# EAGLE design Professional 1.2 (EAGLE 7.7.0)
Professional DOS Original by Wolfgang Moser GAL-Mod by Benutzername@Forum64
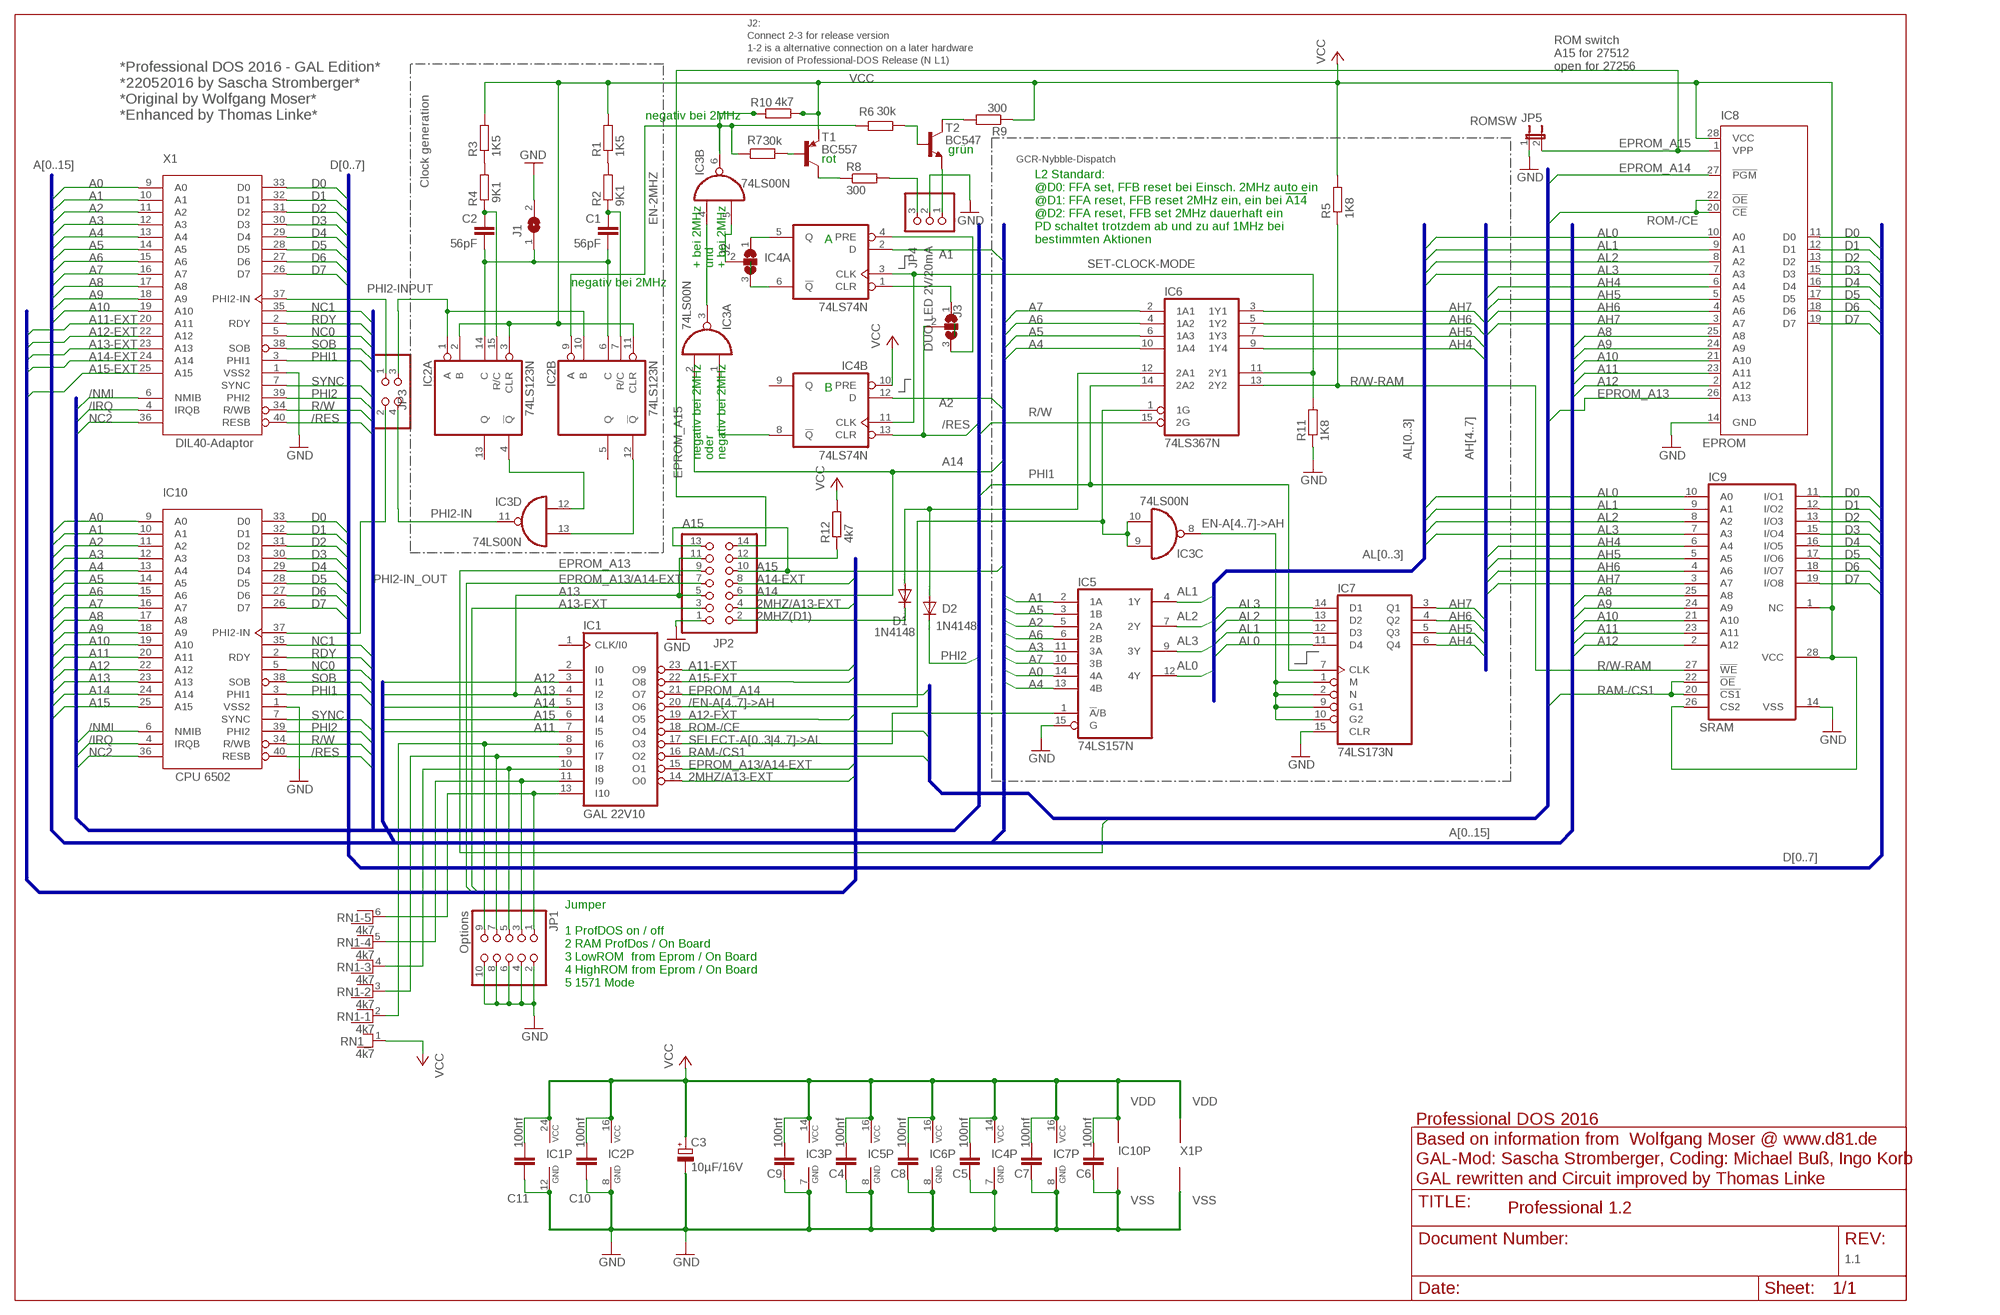
[diagram p0: schematic, sheet 1]

## Parts
C1  56pF  C-EU025-025X050  [C025-025X050]
C2  56pF  C-EU025-025X050  [C025-025X050]
C3  10µF/16V  CPOL-EUTT2D4  [TT2D4]
C4  100nf  C2.5/2  [C2.5-2]
C5  100nf  C2.5/2  [C2.5-2]
C6  100nf  C2.5/2  [C2.5-2]
C7  100nf  C2.5/2  [C2.5-2]
C8  100nf  C2.5/2  [C2.5-2]
C9  100nf  C2.5/2  [C2.5-2]
C10  100nf  C2.5/2  [C2.5-2]
C11  100nf  C2.5/2  [C2.5-2]
D1  1N4148  DIODE-D-5  [D-5]
D2  1N4148  DIODE-D-5  [D-5]
IC1  GAL 22V10  22V10  [DIL24-3]
IC2  74LS123N  [DIL16]
IC3  74LS00N  [DIL14]
IC4  74LS74N  [DIL14]
IC5  74LS157N  [DIL16]
IC6  74LS367N  74HC367N  [DIL16]
IC7  74LS173N  [DIL16]
IC8  EPROM  27C128P  [DIL28-6]
IC9  SRAM  6264A  [DIL28-6]
IC10  CPU 6502  G65SC02P  [DIL40]
J1  1  SJ  [SJ]
J2  Alternativ connection for old version  SJ2W  [SJ_2]
J3  Alternativ connection for old version  SJ2W  [SJ_2]
JP1  Options  PINHD-2X5  [2X05]
JP2  1  PINHD-2X7  [2X07]
JP3  1  PINHD-2X2  [2X02]
JP4  DUO LED 2V/20mA  PINHD-1X3  [1X03]
JP5  ROMSW  JP1E  [JP1]
R1  1K5  R-EU_0207/2V  [0207/2V]
R2  9K1  R-EU_0207/2V  [0207/2V]
R3  1K5  R-EU_0207/2V  [0207/2V]
R4  9K1  R-EU_0207/2V  [0207/2V]
R5  1K8  R-EU_0207/7  [0207/7]
R6  30k  R-EU_0207/2V  [0207/2V]
R7  30k  R-EU_0207/2V  [0207/2V]
R8  300  R-EU_0207/2V  [0207/2V]
R9  300  R-EU_0207/2V  [0207/2V]
R10  4k7  R-EU_0207/2V  [0207/2V]
R11  1K8  R-EU_0207/7  [0207/7]
R12  4k7  R-EU_0207/7  [0207/7]
RN1  4k7  RNX5  [RN-6]
T1  BC557  -PNP-TO92  [TO92]
T2  BC547  [TO92]
X1  DIL40-Adaptor  G65SC02PB  [DIL40-BPLACE]

## Nets
2MHZ(D1): D1.C JP2.2
2MHZ/A13-EXT: IC1.14(O0) JP2.4
/EN-A[4..7]->AH: IC1.20(O6) IC3.9(C:I0) IC3.10(C:I1) IC6.1(1G)
/IRQ: IC10.4(IRQB) X1.4(IRQB)
/NMI: IC10.6(NMIB) X1.6(NMIB)
/Q: IC4.6(A:!Q) J2.3
/RES: IC4.13(B:CLR) IC10.40(RESB) J3.2 X1.40(RESB)
A0: IC5.14(4A) IC10.9(A0) X1.9(A0)
A1: IC4.2(A:D) IC5.2(1A) IC10.10(A1) X1.10(A1)
A2: IC4.12(B:D) IC5.5(2A) IC10.11(A2) X1.11(A2)
A3: IC5.11(3A) IC10.12(A3) X1.12(A3)
A4: IC5.13(4B) IC6.10(1A4) IC10.13(A4) X1.13(A4)
A5: IC5.3(1B) IC6.6(1A3) IC10.14(A5) X1.14(A5)
A6: IC5.6(2B) IC6.4(1A2) IC10.15(A6) X1.15(A6)
A7: IC5.10(3B) IC6.2(1A1) IC10.16(A7) X1.16(A7)
A8: IC8.25(A8) IC9.25(A8) IC10.17(A8) X1.17(A8)
A9: IC8.24(A9) IC9.24(A9) IC10.18(A9) X1.18(A9)
A10: IC8.21(A10) IC9.21(A10) IC10.19(A10) X1.19(A10)
A11: IC1.7(I5) IC8.23(A11) IC9.23(A11) IC10.20(A11)
A11-EXT: IC1.23(O9) X1.20(A11)
A12: IC1.3(I1) IC8.2(A12) IC9.2(A12) IC10.22(A12)
A12-EXT: IC1.19(O5) X1.22(A12)
A13: IC1.4(I2) IC10.23(A13) JP2.5 JP2.11
A13-EXT: JP2.3 X1.23(A13)
A14: IC1.5(I3) IC3.2(A:I1) IC10.24(A14) JP2.6
A14-EXT: JP2.8 X1.24(A14)
A15: IC1.6(I4) IC10.25(A15) JP2.10 JP2.13
A15-EXT: IC1.22(O8) X1.25(A15)
AH4: IC6.9(1Y4) IC7.6(Q4) IC8.6(A4) IC9.6(A4)
AH5: IC6.7(1Y3) IC7.5(Q3) IC8.5(A5) IC9.5(A5)
AH6: IC6.5(1Y2) IC7.4(Q2) IC8.4(A6) IC9.4(A6)
AH7: IC6.3(1Y1) IC7.3(Q1) IC8.3(A7) IC9.3(A7)
AL0: IC5.12(4Y) IC7.11(D4) IC8.10(A0) IC9.10(A0)
AL1: IC5.4(1Y) IC7.12(D3) IC8.9(A1) IC9.9(A1)
AL2: IC5.7(2Y) IC7.13(D2) IC8.8(A2) IC9.8(A2)
AL3: IC5.9(3Y) IC7.14(D1) IC8.7(A3) IC9.7(A3)
CLR: IC4.1(A:CLR) J3.1
D0: IC8.11(D0) IC9.11(I/O1) IC10.33(D0) X1.33(D0)
D1: IC8.12(D1) IC9.12(I/O2) IC10.32(D1) X1.32(D1)
D2: IC8.13(D2) IC9.13(I/O3) IC10.31(D2) X1.31(D2)
D3: IC8.15(D3) IC9.15(I/O4) IC10.30(D3) X1.30(D3)
D4: IC8.16(D4) IC9.16(I/O5) IC10.29(D4) X1.29(D4)
D5: IC8.17(D5) IC9.17(I/O6) IC10.28(D5) X1.28(D5)
D6: IC8.18(D6) IC9.18(I/O7) IC10.27(D6) X1.27(D6)
D7: IC8.19(D7) IC9.19(I/O8) IC10.26(D7) X1.26(D7)
EN-2MHZ: IC2.9(B:A) IC3.6(B:O) R6.2 R7.1 R10.2
EN-A[4..7]->AH: IC3.8(C:O) IC7.1(M) IC7.2(N) IC7.9(G1) IC7.10(G2)
EPROM_A13: IC8.26(A13) JP2.9
EPROM_A13/A14-EXT: IC1.15(O1) JP2.7
EPROM_A14: IC1.21(O7) IC8.27(!PGM)
EPROM_A15: IC8.1(VPP) JP2.14 JP5.2
FETCH_CLOCK_MODE: D1.A D2.A IC6.12(2A1)
GND: C3.- C4.2 C5.2 C6.2 C7.2 C8.2 C9.2 C10.2 C11.2 IC1.12(GND) IC2.8(P:GND) IC3.7(P:GND) IC4.7(P:GND) IC5.8(GND) IC5.15(G) IC6.8(GND) IC7.8(GND) IC7.15(CLR) IC8.14(GND) IC9.14(VSS) IC10.1(VSS2) IC10.21(VSS) J1.2 JP1.2 JP1.4 JP1.6 JP1.8 JP1.10 JP2.1 JP4.2 JP5.1 R11.1 X1.1(VSS2) X1.21(VSS)
N$1: R3.1 R4.2
N$2: C1.2 C2.2 IC2.6(B:C) IC2.14(A:C) J1.1
N$3: C2.1 IC2.15(A:R/C) R4.1
N$4: C1.1 IC2.7(B:R/C) R2.1
N$5: R1.1 R2.2
N$6: IC2.4(A:!Q) IC3.12(D:I0)
N$7: R7.2 T1.2(B)
N$8: IC2.12(B:!Q) IC3.13(D:I1)
N$9: IC3.5(B:I1) J2.2
N$10: R6.1 T2.2(B)
N$11: IC3.3(A:O) IC3.4(B:I0)
N$12: IC3.1(A:I0) IC4.8(B:!Q)
N$13: JP4.1 T2.1(E)
N$14: R9.2 T2.3(C)
N$21: JP4.3 R8.2
N$22: R8.1 T1.3(C)
NC0: IC10.5(NC$3) X1.5(NC$3)
NC1: IC10.35(NC$1) X1.35(NC$1)
NC2: IC10.36(NC$2) X1.36(NC$2)
ON-OFF: IC1.13(I10) JP1.1 RN1.6
OPT2: IC1.11(I9) JP1.3 RN1.5
OPT3: IC1.10(I8) JP1.5 RN1.4
OPT4: IC1.9(I7) JP1.7 RN1.3
OPT5: IC1.8(I6) JP1.9 RN1.2
PHI1: IC6.14(2A2) IC7.7(CLK) IC10.3(PHI1) X1.3(PHI1)
PHI2: D2.C IC10.39(PHI2) X1.39(PHI2)
PHI2-IN: IC3.11(D:O) JP3.4
PHI2-IN_OUT: IC10.37(PHI2-IN) JP3.2
PHI2-INPUT: JP3.1 X1.37(PHI2-IN)
PHI2-INPUT_OUT: IC2.1(A:A) IC2.10(B:B) JP3.3
PRE: IC4.4(A:PRE) J3.3
PULLUP: JP2.12 R12.1
Q: IC4.5(A:Q) J2.1
R/W: IC6.15(2G) IC10.34(R/WB) X1.34(R/WB)
R/W-RAM: IC6.13(2Y2) IC9.27(!WE) R5.1
RAM-/CS1: IC1.16(O2) IC9.20(!CS1) IC9.22(!OE)
RDY: IC10.2(RDY) X1.2(RDY)
ROM-/CE: IC1.18(O4) IC8.20(!CE) IC8.22(!OE)
SELECT-A[0..3|4..7]->AL: IC1.17(O3) IC5.1(!A!/B)
SET-CLOCK-MODE: IC4.3(A:CLK) IC4.11(B:CLK) IC6.11(2Y1) R11.2
SOB: IC10.38(SOB) X1.38(SOB)
SYNC: IC10.7(SYNC) X1.7(SYNC)
VCC: C3.+ C4.1 C5.1 C6.1 C7.1 C8.1 C9.1 C10.1 C11.1 IC1.24(VCC) IC2.2(A:B) IC2.3(A:CLR) IC2.11(B:CLR) IC2.16(P:VCC) IC3.14(P:VCC) IC4.10(B:PRE) IC4.14(P:VCC) IC5.16(VCC) IC6.16(VCC) IC7.16(VCC) IC8.28(VCC) IC9.1(NC) IC9.26(CS2) IC9.28(VCC) IC10.8(VDD) R1.2 R3.2 R5.2 R9.1 R10.1 R12.2 RN1.1 T1.1(E) X1.8(VDD)
Unconnected: IC1.1(CLK/I0) IC1.2(I0) IC2.5(B:Q) IC2.13(A:Q) IC4.9(B:Q)

## Buses
A[0..15]
D[0..7]
PROC_MISC:RDY,PHI[1..2],/IRQ,NC[0..2],/NMI,SYNC,R/W,SOB,/RES
AH[4..7]
AL[0..3]
RAM-/CS1,ROM-/CE,EPROM_A13,EPROM_A14
A11-EXT,A12-EXT,A13-EXT,A14-EXT,A15-EXT,A14/A15-EXT,2MHZ/A13-EXT,EPROM_A13/A14-EXT

## Notes on the sheet
- J2:
- Connect 2-3 for release version
- 1-2 is a alternative connection on a later hardware
- revision of Professional-DOS Release (N L1)
- ROM switch
  A15 for 27512
  open for 27256
- *Professional DOS 2016 - GAL Edition*
  *22052016 by Sascha Stromberger*
  *Original by Wolfgang Moser*
  *Enhanced by Thomas Linke*
- negativ bei 2MHz
- grün
- rot | GCR-Nybble-Dispatch
- Clock generation
- A
- L2 Standard:
  @D0: FFA set, FFB reset bei Einsch. 2MHz auto ein
  @D1: FFA reset, FFB reset 2MHz ein, ein bei !A14
  @D2: FFA reset, FFB set 2MHz dauerhaft ein
  PD schaltet trotzdem ab und zu auf 1MHz bei
  bestimmten Aktionen
- + bei 2MHz | und | + bei 2MHz
- negativ bei 2MHz
- B
- negativ bei 2MHz | oder | negativ bei 2MHz
- Jumper
  
  1 ProfDOS on / off
  2 RAM ProfDos / On Board
  3 LowROM  from Eprom / On Board
  4 HighROM from Eprom / On Board
  5 1571 Mode
- Professional DOS 2016
  Based on information from  Wolfgang Moser @ www.d81.de
  GAL-Mod: Sascha Stromberger, Coding: Michael Buß, Ingo Korb
  GAL rewritten and Circuit improved by Thomas Linke
- 1.1

## Library data of the parts
C1 C2 = rcl:C-EU: CAPACITOR, European symbol
C3 = rcl:CPOL-EU: POLARIZED CAPACITOR, European symbol
C4-C11 = capacitor-wima:C: CAPACITOR naming: grid - package width
D1 D2 = diode:DIODE-: DIODE
IC1 = pal:22V10: PAL; MPN: GAL22V10D-7LPN; OC_FARNELL: 1571925; OC_NEWARK: 97M0480
IC2 = 74xx-eu:74*123: Retriggerable monostable MULTIVIBRATOR
IC3 = 74xx-eu:74*00: Quad 2-input NAND gate
IC4 = 74xx-eu:74*74: Dual D type positive edge triggered FLIP FLOP, preset and clear
IC5 = 74xx-eu:74*157: Quadruple 2-line to 1-line data SELECTOR/MULTIPLEXER
IC6 = 74xx-eu:74*367: Hex BUS DRIVER, 3-state
IC7 = 74xx-eu:74*173: 4-bit D type REGISTER, 3-state
IC8 = microchip:27*128: CMOS EPROM 128 K (16 K x 8); OC_FARNELL: unknown; OC_NEWARK: unknown
IC9 = memory-hitachi:6264A: MEMORY; OC_FARNELL: 283605; OC_NEWARK: unknown
IC10 X1 = csg65xxx:G65SC02P
J1 = jumper:SJ: SMD solder JUMPER
J2 J3 = jumper:SJ2W: SMD solder JUMPER
JP1 = pinhead:PINHD-2X5: PIN HEADER
JP2 = pinhead_eckig:PINHD-2X7: PIN HEADER
JP3 = pinhead:PINHD-2X2: PIN HEADER
JP4 = pinhead:PINHD-1X3: PIN HEADER
JP5 = jumper:JP1E: JUMPER
R1-R12 = rcl:R-EU_: RESISTOR, European symbol
RN1 = resistor-net:RNX5: RESISTOR NETWORK
T1 = transistor:*-PNP-: PNP Transistror
T2 = transistor:BC547: NPN TRANSISTOR

## Board
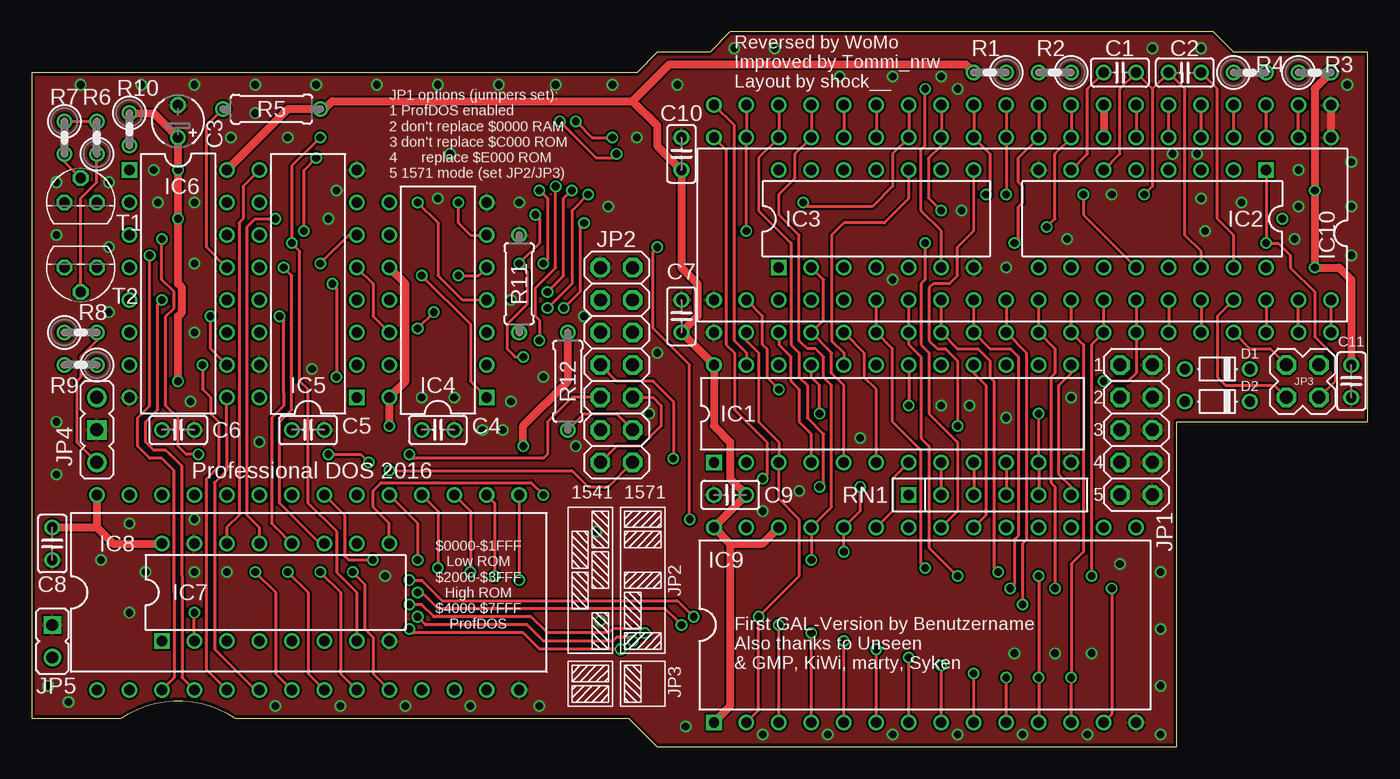
[diagram p1: board, top side]
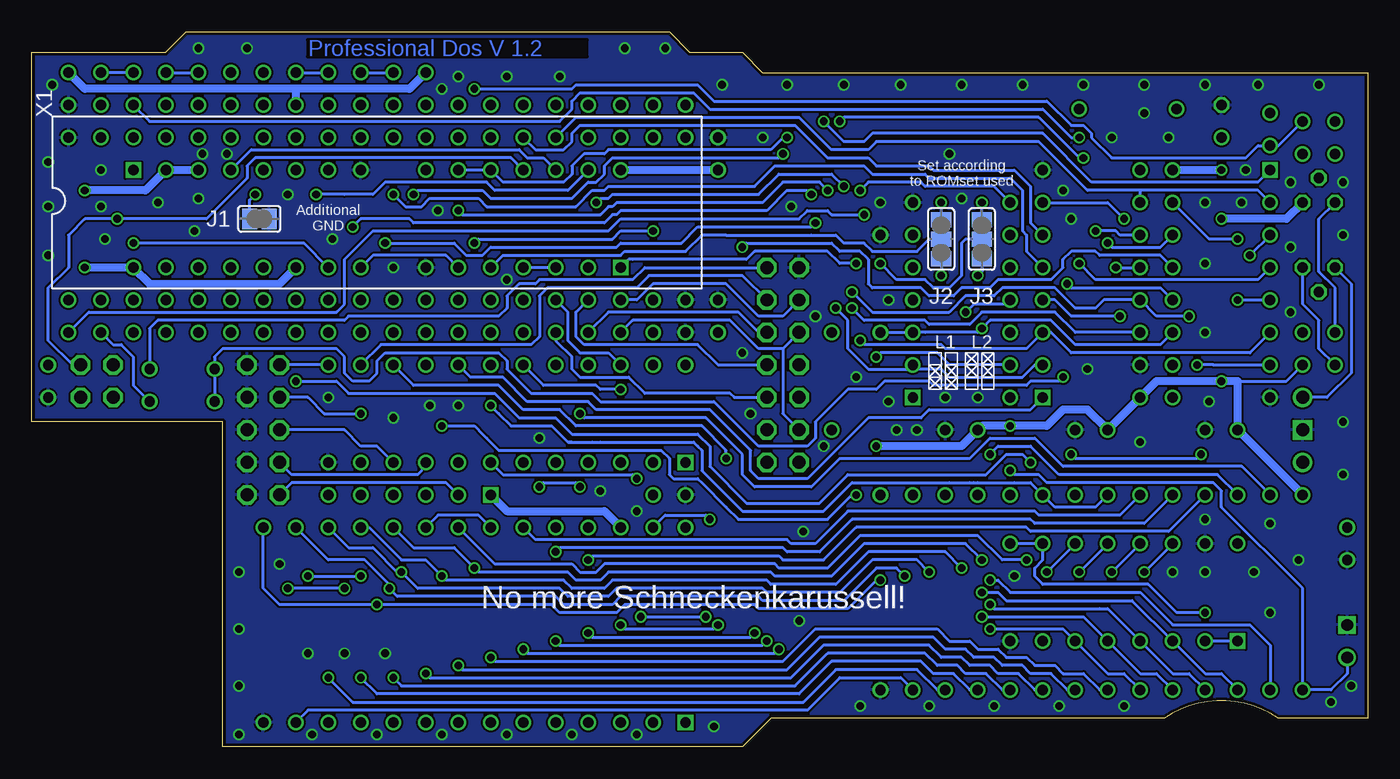
[diagram p2: board, bottom side, seen from below]

Size 104.46 x 55.88 mm. Coordinates in mm from the lower left corner, seen from the top.
Outline: 0,2.22 6.99,2.22 arc-68 15.88,2.22 46.67,2.22 48.89,0 89.54,0 89.54,25.4 104.46,25.4 104.46,54.29 93.98,54.29 92.39,55.88 54.61,55.88 53.02,54.29 48.89,54.29 47.31,52.7 0,52.7 0,2.22
Copper layers (1*16): Top 0.0356mm / dielectric 1.5011mm / Bottom 0.0356mm
Design rules "default": minimum track width 6mil, minimum drill 0.3mm, track to track 6mil, track to pad 6mil, pad to pad 6mil, via to via 6mil, smd to smd 6mil, copper to edge 0.25mm, drill to drill 6mil, minimum pad ring 6mil, minimum via ring 6mil, stop-mask expansion 0mil, vias tented up to drill 0.3mm, thermal gap 6mil

### Footprints (pad centres in the part's own frame; a part is rotated, then mirrored left to right if it is on the bottom)
C025-025X050 = drill 0.813: 1 -1.27,0; 2 1.27,0
TT2D4 = drill 0.813: + -1.27,0 | drill 0.813 octagon: - 1.27,0
C2.5-2 = drill 0.813: 1 -1.27,0; 2 1.27,0
D-5 = drill 0.813: A 2.54,0; C -2.54,0
DIL24-3 = drill 0.813 square: 1 -13.97,-3.81 | drill 0.813: 2 -11.43,-3.81; 3 -8.89,-3.81; 4 -6.35,-3.81; 5 -3.81,-3.81; 6 -1.27,-3.81; 7 1.27,-3.81; 8 3.81,-3.81; 9 6.35,-3.81; 10 8.89,-3.81; 11 11.43,-3.81; 12 13.97,-3.81; 13 13.97,3.81; 14 11.43,3.81; 15 8.89,3.81; 16 6.35,3.81; 17 3.81,3.81; 18 1.27,3.81; 19 -1.27,3.81; 20 -3.81,3.81; 21 -6.35,3.81; 22 -8.89,3.81; 23 -11.43,3.81; 24 -13.97,3.81
DIL16 = drill 0.813 square: 1 -8.89,-3.81 | drill 0.813: 2 -6.35,-3.81; 3 -3.81,-3.81; 4 -1.27,-3.81; 5 1.27,-3.81; 6 3.81,-3.81; 7 6.35,-3.81; 8 8.89,-3.81; 9 8.89,3.81; 10 6.35,3.81; 11 3.81,3.81; 12 1.27,3.81; 13 -1.27,3.81; 14 -3.81,3.81; 15 -6.35,3.81; 16 -8.89,3.81
DIL14 = drill 0.813 square: 1 -7.62,-3.81 | drill 0.813: 2 -5.08,-3.81; 3 -2.54,-3.81; 4 0,-3.81; 5 2.54,-3.81; 6 5.08,-3.81; 7 7.62,-3.81; 8 7.62,3.81; 9 5.08,3.81; 10 2.54,3.81; 11 0,3.81; 12 -2.54,3.81; 13 -5.08,3.81; 14 -7.62,3.81
DIL28-6 = drill 0.813: 1 -16.51,-7.62; 2 -13.97,-7.62; 3 -11.43,-7.62; 4 -8.89,-7.62; 5 -6.35,-7.62; 6 -3.81,-7.62; 7 -1.27,-7.62; 8 1.27,-7.62; 9 3.81,-7.62; 10 6.35,-7.62; 11 8.89,-7.62; 12 11.43,-7.62; 13 13.97,-7.62; 14 16.51,-7.62; 15 16.51,7.62; 16 13.97,7.62; 17 11.43,7.62; 18 8.89,7.62; 19 6.35,7.62; 20 3.81,7.62; 21 1.27,7.62; 22 -1.27,7.62; 23 -3.81,7.62; 24 -6.35,7.62; 25 -8.89,7.62; 26 -11.43,7.62; 27 -13.97,7.62; 28 -16.51,7.62
DIL28-6' = drill 0.813 square: 1 -16.51,-7.62 | drill 0.813: 2 -13.97,-7.62; 3 -11.43,-7.62; 4 -8.89,-7.62; 5 -6.35,-7.62; 6 -3.81,-7.62; 7 -1.27,-7.62; 8 1.27,-7.62; 9 3.81,-7.62; 10 6.35,-7.62; 11 8.89,-7.62; 12 11.43,-7.62; 13 13.97,-7.62; 14 16.51,-7.62; 15 16.51,7.62; 16 13.97,7.62; 17 11.43,7.62; 18 8.89,7.62; 19 6.35,7.62; 20 3.81,7.62; 21 1.27,7.62; 22 -1.27,7.62; 23 -3.81,7.62; 24 -6.35,7.62; 25 -8.89,7.62; 26 -11.43,7.62; 27 -13.97,7.62; 28 -16.51,7.62
DIL40 = drill 0.813: 1 -24.13,-7.62; 2 -21.59,-7.62; 3 -19.05,-7.62; 4 -16.51,-7.62; 5 -13.97,-7.62; 6 -11.43,-7.62; 7 -8.89,-7.62; 8 -6.35,-7.62; 9 -3.81,-7.62; 10 -1.27,-7.62; 11 1.27,-7.62; 12 3.81,-7.62; 13 6.35,-7.62; 14 8.89,-7.62; 15 11.43,-7.62; 16 13.97,-7.62; 17 16.51,-7.62; 18 19.05,-7.62; 19 21.59,-7.62; 20 24.13,-7.62; 21 24.13,7.62; 22 21.59,7.62; 23 19.05,7.62; 24 16.51,7.62; 25 13.97,7.62; 26 11.43,7.62; 27 8.89,7.62; 28 6.35,7.62; 29 3.81,7.62; 30 1.27,7.62; 31 -1.27,7.62; 32 -3.81,7.62; 33 -6.35,7.62; 34 -8.89,7.62; 35 -11.43,7.62; 36 -13.97,7.62; 37 -16.51,7.62; 38 -19.05,7.62; 39 -21.59,7.62; 40 -24.13,7.62
SJ = smd 1.168 x 1.6: 1 -0.762,0; 2 0.762,0
SJ_2 = smd 1.168 x 1.6: 1 -1.524,0; 2 0,0; 3 1.524,0
2X05 = drill 1.016 octagon: 1 -5.08,-1.27; 2 -5.08,1.27; 3 -2.54,-1.27; 4 -2.54,1.27; 5 0,-1.27; 6 0,1.27; 7 2.54,-1.27; 8 2.54,1.27; 9 5.08,-1.27; 10 5.08,1.27
2X07 = drill 1.016 octagon: 1 -7.62,-1.27; 2 -7.62,1.27; 3 -5.08,-1.27; 4 -5.08,1.27; 5 -2.54,-1.27; 6 -2.54,1.27; 7 0,-1.27; 8 0,1.27; 9 2.54,-1.27; 10 2.54,1.27; 11 5.08,-1.27; 12 5.08,1.27; 13 7.62,-1.27; 14 7.62,1.27
2X02 = drill 1.016 octagon: 1 -1.27,-1.27; 2 -1.27,1.27; 3 1.27,-1.27; 4 1.27,1.27
1X03 = drill 1.016: 1 -2.54,0; 3 2.54,0 | drill 1.016 square: 2 0,0
JP1 = drill 0.914 square: 1 0,-1.27 | drill 0.914: 2 0,1.27
0207/2V = drill 0.813: 1 -1.27,0; 2 1.27,0
0207/7 = drill 0.813: 1 -3.81,0; 2 3.81,0
RN-6 = drill 0.813 square: 1 -6.35,0 | drill 0.813: 2 -3.81,0; 3 -1.27,0; 4 1.27,0; 5 3.81,0; 6 6.35,0
TO92 = drill 0.813 octagon: 1 1.27,0; 2 0,1.905; 3 -1.27,0
DIL40-BPLACE = drill 0.813: 1 -24.13,-7.62; 2 -21.59,-7.62; 3 -19.05,-7.62; 4 -16.51,-7.62; 5 -13.97,-7.62; 6 -11.43,-7.62; 7 -8.89,-7.62; 8 -6.35,-7.62; 9 -3.81,-7.62; 10 -1.27,-7.62; 11 1.27,-7.62; 12 3.81,-7.62; 13 6.35,-7.62; 14 8.89,-7.62; 15 11.43,-7.62; 16 13.97,-7.62; 17 16.51,-7.62; 18 19.05,-7.62; 19 21.59,-7.62; 20 24.13,-7.62; 21 24.13,7.62; 22 21.59,7.62; 23 19.05,7.62; 24 16.51,7.62; 25 13.97,7.62; 26 11.43,7.62; 27 8.89,7.62; 28 6.35,7.62; 29 3.81,7.62; 30 1.27,7.62; 31 -1.27,7.62; 32 -3.81,7.62; 33 -6.35,7.62; 34 -8.89,7.62; 35 -11.43,7.62; 36 -13.97,7.62; 37 -16.51,7.62; 38 -19.05,7.62; 39 -21.59,7.62; 40 -24.13,7.62

### Placement (x,y rotation side)
C1  85.09,52.7 0 top
C2  90.17,52.7 180 top
C3  11.43,48.89 90 top
C4  31.75,24.76 0 top
C5  21.59,24.76 0 top
C6  11.43,24.76 0 top
C7  50.8,33.66 90 top
C8  1.59,15.88 270 top
C9  54.61,19.68 180 top
C10  50.8,46.35 90 top
C11  103.19,28.57 270 top
D1  92.71,29.53 180 top
D2  92.71,26.99 180 top
IC1  67.31,26.04 0 top
IC2  87.63,41.27 180 top
IC3  66.04,41.27 0 top
IC4  31.75,34.92 90 top
IC5  21.59,36.2 90 top
IC6  11.43,36.2 270 top
IC7  19.05,12.06 0 top
IC8  21.59,12.06 0 top
IC9  SRAM  [DIL28-6']  69.85,9.53 0 top
IC10  77.47,40 180 top
J1  86.68,41.27 0 bottom
J2  33.34,39.69 90 bottom
J3  30.16,39.69 90 bottom
JP1  86.36,24.76 270 top
JP2  45.72,29.84 270 top
JP3  99.38,28.57 0 top
JP4  5.08,24.76 270 top
JP5  1.59,8.26 180 top
R1  74.93,52.7 180 top
R2  80.01,52.7 180 top
R3  100.33,52.7 0 top
R4  95.25,52.7 0 top
R5  18.73,49.85 0 top
R6  5.08,47.62 90 top
R7  2.54,47.62 270 top
R8  3.81,32.38 0 top
R9  3.81,29.84 180 top
R10  7.62,48.26 270 top
R11  38.1,36.2 270 top
R12  41.91,28.57 90 top
RN1  74.93,19.68 0 top
T1  3.81,42.55 0 top
T2  3.81,37.46 180 top
X1  77.47,42.55 180 top

### Tracks (layer width: path | path; a pad name or v marks a point on that pad's centre or on a via)
2MHZ(D1)
  Bottom 0.254: JP2.2 56.52,37.46 57.47,36.51 64.77,36.51 65.09,36.2 66.36,36.2 67.31,35.24 67.31,34.29 67.95,33.66 79.69,33.66 80.01,33.34 94.62,33.34 95.25,32.7 D1.C
2MHZ/A13-EXT
  Bottom 0.254: IC1.14 77.15,31.43 65.41,31.43 64.77,32.07 64.77,35.24 64.13,35.88 57.15,35.88 56.2,36.83 48.89,36.83 JP2.4
/EN-A[4..7]->AH  (via drill 0.6)
  Top 0.254: IC3.10 68.58,42.86 66.67,40.96 63.5,40.96 62.55,40 62.55,31.75 63.5,30.8 IC1.20 | v42.54,48.89 43.81,47.63 v45.4,47.63
  Bottom 0.254: IC3.9 IC3.10 67.63,44.13 62.86,44.13 62.23,44.77 62.23,45.4 61.28,46.35 59.69,46.35 59.37,46.67 46.67,46.67 45.72,47.63 v45.4,47.63 | IC6.1 8.57,44.13 21.59,44.13 25.4,47.94 38.74,47.94 39.37,47.31 40.96,47.31 v42.54,48.89
/IRQ
  Top 0.254: IC10.4 X1.4
/NMI
  Top 0.254: IC10.6 X1.6
/Q  (via drill 0.6)
  Top 0.254: v33.34,42.55 33.34,40.96 34.29,40 IC4.6
  Bottom 0.254: J2.3 v33.34,42.55
/RES  (via drill 0.6)
  Top 0.254: X1.40 IC10.40 | v39.37,41.59 39.69,41.28 39.69,39.37 v38.1,37.78 38.74,37.15 38.74,34.61 37.15,33.02 37.15,31.11 37.78,30.48 v38.42,30.48
  Bottom 0.254: IC4.13 32.7,29.85 33.65,30.8 38.1,30.8 v38.42,30.48 | J3.2 31.43,39.69 31.75,39.37 31.75,36.83 32.7,35.88 33.97,35.88 34.61,36.51 36.83,36.51 v38.1,37.78 | IC10.40 100.01,33.97 80.65,33.97 80.01,34.61 80.01,38.1 77.79,40.32 59.37,40.32 58.42,41.28 44.45,41.28 43.81,41.91 42.23,41.91 41.91,41.59 v39.37,41.59
A0  (via drill 0.6)
  Top 0.254: X1.9 IC10.9 80.01,46.35 80.01,41.28 v79.37,40.64 | v43.5,43.18 42.23,41.91 42.23,36.2 v40.32,34.29
  Bottom 0.254: IC5.14 22.86,32.38 24.45,33.97 30.16,33.97 31.12,33.02 34.29,33.02 34.61,33.34 39.37,33.34 v40.32,34.29 | v43.5,43.18 43.81,43.5 45.4,43.5 46.99,41.91 58.42,41.91 58.74,41.59 59.06,41.59 59.69,40.96 74.61,40.96 74.93,41.28 78.74,41.28 v79.37,40.64
A1  (via drill 0.6)
  Top 0.254: X1.10 IC10.10 77.15,46.04 77.15,44.13 77.47,43.81 77.47,42.55 77.15,42.23 77.15,39.69 v76.84,39.37 | v43.18,40.96 42.86,40.64 42.86,35.56 v41.59,34.29
  Bottom 0.254: IC5.2 26.03,29.85 26.99,28.89 32.7,28.89 33.34,29.53 35.24,29.53 IC4.2 35.88,29.53 39.05,29.53 40.64,31.11 40.64,33.34 v41.59,34.29 | v76.84,39.37 71.44,39.37 70.49,38.42 69.21,38.42 68.58,39.05 58.74,39.05 58.42,39.37 53.66,39.37 52.39,40.64 43.5,40.64 v43.18,40.96
A2  (via drill 0.6)
  Top 0.254: X1.11 IC10.11 v76.2,43.18 | IC5.5 26.67,36.2 26.67,33.66 IC4.12
  Bottom 0.254: v76.2,43.18 75.25,42.23 73.98,42.23 73.34,42.86 69.53,42.86 68.9,42.23 61.91,42.23 60.64,43.5 59.69,43.5 59.37,43.81 47.94,43.81 46.35,45.4 39.37,45.4 38.74,44.77 34.61,44.77 34.29,44.45 27.94,44.45 26.99,43.5 26.99,40.32 26.67,40 26.67,38.74 IC5.5
A3  (via drill 0.6)
  Top 0.254: X1.12 IC10.12 74.93,46.35 74.93,43.5 v74.61,43.18 | v21.27,40.32 21.27,45.09 v22.22,46.04 | v41.28,48.89 44.13,46.04 45.4,46.04 v45.72,46.35
  Bottom 0.254: v74.61,43.18 74.29,43.5 69.21,43.5 68.58,42.86 62.23,42.86 60.96,44.13 60.32,44.13 59.69,44.77 59.69,45.4 59.06,46.04 46.04,46.04 v45.72,46.35 | IC5.11 19.37,40 19.69,40.32 v21.27,40.32 | v41.28,48.89 40.96,49.21 25.72,49.21 22.54,46.04 v22.22,46.04
A4  (via drill 0.6)
  Top 0.254: X1.13 IC10.13 71.12,46.99 70.17,46.04 70.17,42.86 v71.12,41.91 | IC6.10 13.97,31.11 v13.97,33.66 | v40.32,35.56 41.59,36.83 41.59,42.86 v42.23,43.5
  Bottom 0.254: v13.97,33.66 16.51,33.66 IC5.13 20.64,34.92 21.27,34.29 22.86,34.29 24.45,35.88 28.58,35.88 29.21,35.24 31.43,35.24 32.7,33.97 38.74,33.97 v40.32,35.56 | v71.12,41.91 70.8,41.59 60.01,41.59 59.37,42.23 59.06,42.23 58.74,42.55 47.31,42.55 45.72,44.13 42.86,44.13 v42.23,43.5
A5  (via drill 0.6)
  Top 0.254: X1.14 IC10.14 67.31,46.35 67.31,43.81 65.72,42.23 60.64,42.23 v60.32,42.55 | 40.96,44.13 v40.96,43.81 40.96,37.46 39.37,35.88 39.37,33.66 39.69,33.34 v39.69,31.75
  Bottom 0.254: IC6.6 9.21,30.8 23.18,30.8 24.76,32.38 IC5.3 26.67,31.11 33.02,31.11 33.34,31.43 39.37,31.43 v39.69,31.75 | v60.32,42.55 60.01,42.86 59.37,42.86 59.06,43.18 47.63,43.18 46.04,44.77 41.91,44.77 v40.96,43.81
A6  (via drill 0.6)
  Top 0.254: X1.15 IC10.15 | IC5.6 24.76,40 v22.54,37.78
  Bottom 0.254: IC6.4 8.57,36.51 21.27,36.51 v22.54,37.78 | IC10.15 65.09,46.67 62.86,46.67 62.23,47.31 62.23,47.94 61.6,48.58 44.77,48.58 42.23,46.04 39.05,46.04 38.42,45.4 34.29,45.4 33.97,45.09 27.62,45.09 26.35,43.81 26.35,40.96 IC5.6
A7
  Top 0.254: X1.16 IC10.16
  Bottom 0.254: IC6.2 8.57,43.5 17.78,43.5 | IC5.10 17.78,43.5 | 17.78,43.5 21.91,43.5 25.72,47.31 38.42,47.31 39.05,46.67 41.91,46.67 44.45,49.21 61.91,49.21 IC10.16
A8  (via drill 0.6)
  Top 0.254: X1.17 IC10.17 59.69,46.35 59.69,44.45 58.42,43.18 58.42,41.59 60.01,40 60.01,31.75 60.64,31.11 61.28,31.11 61.91,30.48 61.91,28.89 62.55,28.26 62.55,18.73 IC9.25 v60.96,14.61
  Bottom 0.254: IC8.25 15.56,16.83 26.35,16.83 26.67,17.14 40.01,17.14 42.54,14.61 45.72,14.61 46.04,14.92 60.64,14.92 v60.96,14.61
A9  (via drill 0.6)
  Top 0.254: X1.18 IC10.18 56.83,46.04 56.83,41.91 59.37,39.37 59.37,31.43 60.01,30.8 60.01,28.89 60.64,28.26 60.64,25.72 61.91,24.45 61.91,20.64 v61.6,20.32 | v64.77,20.32 64.77,18.42 IC9.24 v63.5,15.24
  Bottom 0.254: v64.77,20.32 64.45,20.64 61.91,20.64 v61.6,20.32 | IC8.24 17.46,17.46 26.03,17.46 26.35,17.78 40.32,17.78 42.86,15.24 45.4,15.24 45.72,15.56 63.18,15.56 v63.5,15.24
A10  (via drill 0.6)
  Top 0.254: X1.19 IC10.19 v55.88,40.32 | IC9.21 72.39,18.42 72.39,23.81 70.17,26.04 70.17,30.8 69.53,31.43 69.53,36.2 69.85,36.51 v69.85,39.37 | IC8.21 24.45,18.1 24.45,14.92 24.76,14.61 v26.67,14.61
  Bottom 0.254: v26.67,14.61 28.58,14.61 30.48,16.51 39.69,16.51 42.23,13.97 46.04,13.97 46.35,14.29 59.69,14.29 60.32,13.65 61.6,13.65 62.23,14.29 68.26,14.29 IC9.21 68.9,14.92 | v55.88,40.32 58.42,40.32 59.06,39.69 69.53,39.69 v69.85,39.37
A11  (via drill 0.6)
  Top 0.254: IC10.20 54.29,46.67 54.29,31.43 54.93,30.8 54.93,26.35 57.47,23.81 57.47,21.27 v57.15,20.95 | IC9.23 67.31,18.42 67.31,20.95 IC1.7
  Bottom 0.254: IC8.23 19.37,18.1 25.72,18.1 26.03,18.42 40.64,18.42 43.18,15.87 45.09,15.87 45.4,16.19 65.09,16.19 IC9.23 | IC1.7 67.63,21.27 57.47,21.27 v57.15,20.95
A11-EXT
  Top 0.254: X1.20 54.93,48.58 54.93,31.75 55.88,30.8 IC1.23
A12  (via drill 0.6)
  Top 0.254: IC9.2 56.83,2.86 v56.83,10.16 60.01,13.34 60.01,17.78 58.42,19.37 IC1.3 58.42,23.81 56.83,25.4 56.83,30.8 55.88,31.75 IC10.22 | v51.75,10.16 50.48,11.43 32.07,11.43 30.48,13.02 v29.53,13.02
  Bottom 0.254: v29.53,13.02 28.89,13.02 27.94,12.06 17.78,12.06 15.24,9.53 9.21,9.53 7.62,7.94 IC8.2 | v56.83,10.16 v51.75,10.16
A12-EXT  (via drill 0.6)
  Top 0.254: X1.22 57.15,33.66 57.15,31.43 57.47,31.11 57.47,28.89 v58.42,27.94
  Bottom 0.254: v58.42,27.94 60.01,27.94 60.32,28.26 64.45,28.26 IC1.19
A13
  Top 0.254: IC10.23 58.42,31.43 59.37,30.48 59.37,28.58 60.01,27.94 60.01,25.4 60.96,24.45 IC1.4
  Bottom 0.254: 45.72,31.11 47.63,31.11 49.85,33.34 57.47,33.34 IC10.23 | JP2.5 45.72,31.11 | 45.72,31.11 45.72,26.04 JP2.11
A13-EXT
  Bottom 0.254: X1.23 57.15,34.92 55.88,36.2 50.17,36.2 47.63,33.66 45.72,33.66 JP2.3
A14
  Top 0.254: IC1.5 63.5,28.26 62.55,29.21 62.55,30.8 IC10.24 61.91,33.34 61.91,36.51 IC3.2
  Bottom 0.254: IC10.24 59.37,33.97 49.21,33.97 47.63,32.38 JP2.6
A14-EXT
  Bottom 0.254: X1.24 61.91,33.97 61.91,32.07 61.28,31.43 52.39,31.43 50.8,29.85 JP2.8
A15
  Top 0.254: IC1.6 66.04,27.94 65.09,28.89 65.09,30.8 IC10.25 | JP2.10 48.58,27.31 49.21,26.67 49.21,25.08 47.63,23.49 45.72,23.49 JP2.13
  Bottom 0.254: IC10.25 63.5,31.75 62.23,30.48 62.23,29.53 61.6,28.89 57.78,28.89 56.52,27.62 49.85,27.62 49.53,27.31 JP2.10
A15-EXT
  Bottom 0.254: X1.25 62.55,33.97 62.55,31.75 61.6,30.8 59.37,30.8 IC1.22
AH4  (via drill 0.6)
  Top 0.254: IC9.6 v66.04,7.62 | IC8.6 17.46,4.44 16.51,5.4 14.29,7.62 14.29,20.64 15.24,21.59 15.24,24.45 IC6.9 | v46.04,7.62 39.69,7.62 39.37,7.94 38.42,8.89 33.65,8.89 29.85,8.89 v29.53,9.21
  Bottom 0.254: v66.04,7.62 65.72,7.3 46.35,7.3 v46.04,7.62 | v29.53,9.21 29.21,9.21 23.81,9.21 | 23.81,9.21 IC7.6 | 23.81,9.21 IC7.6 | IC7.6 20.32,5.72 19.05,5.72 IC8.6
AH5  (via drill 0.6)
  Top 0.254: IC9.5 v63.5,8.26 | v13.34,29.85 13.34,27.94 13.97,27.31 13.97,26.04 14.6,25.4 14.6,23.49 14.6,21.91 13.65,20.95 13.65,6.03 13.97,5.72 IC8.5 | v46.99,8.26 46.67,8.57 45.72,8.57 45.4,8.26 40.01,8.26 38.74,9.53 33.65,9.53 30.8,9.53 v30.16,10.16
  Bottom 0.254: v63.5,8.26 63.18,7.94 47.31,7.94 v46.99,8.26 | v30.16,10.16 29.53,10.16 27.31,10.16 26.99,10.16 22.22,10.16 | 22.22,10.16 IC7.5 | 22.22,10.16 IC7.5 | IC6.7 10.8,29.85 12.07,29.85 v13.34,29.85 | IC7.5 17.78,5.72 16.51,5.72 IC8.5
AH6  (via drill 0.6)
  Top 0.254: IC9.4 v60.96,8.89 | v10.16,34.92 9.84,34.61 9.84,26.35 8.89,25.4 8.89,23.81 9.53,23.18 10.48,23.18 10.8,22.86 11.75,21.91 11.75,13.34 11.75,11.11 11.75,10.79 11.75,5.4 IC8.4 | v47.94,8.89 47.63,9.21 45.4,9.21 45.09,8.89 40.32,8.89 39.05,10.16 33.65,10.16 31.43,10.16 30.48,11.11 v29.53,11.11
  Bottom 0.254: v60.96,8.89 60.64,8.57 48.26,8.57 v47.94,8.89 | v29.53,11.11 29.21,10.79 20.96,10.79 20.32,10.79 | 20.32,10.79 IC7.4 | 20.32,10.79 IC7.4 | v10.16,34.92 IC6.5 | IC7.4 15.24,5.72 13.97,5.72 IC8.4
AH7  (via drill 0.6)
  Top 0.254: IC9.3 v58.42,9.53 | v9.21,38.42 9.21,26.67 8.25,25.72 8.25,23.49 9.21,22.54 10.16,22.54 11.11,21.59 11.11,12.06 11.11,5.4 IC8.3 | v50.8,9.53 50.48,9.84 49.53,10.79 33.65,10.79 31.75,10.79 30.48,12.06 v30.16,12.06
  Bottom 0.254: v58.42,9.53 58.1,9.21 51.12,9.21 v50.8,9.53 | v30.16,12.06 28.89,12.06 28.26,11.43 18.41,11.43 | 18.41,11.43 IC7.3 | 18.41,11.43 IC7.3 | IC6.3 v9.21,38.42 | IC7.3 12.7,5.72 11.43,5.72 IC8.3
AL0  (via drill 0.6)
  Top 0.254: IC8.10 26.67,5.72 26.67,8.57 26.03,9.21 26.03,12.7 v25.08,13.65 | IC9.10 v76.2,5.4 | v19.69,37.46 20.32,36.83 20.32,34.92 20.32,33.34 20.32,26.35 19.37,25.4 19.37,24.45 19.37,23.81 19.37,19.05 22.54,15.87 IC7.11
  Bottom 0.254: v76.2,5.4 75.57,4.76 44.77,4.76 42.23,7.3 34.61,7.3 33.65,6.35 32.07,6.35 31.43,5.72 29.85,5.72 28.58,4.44 IC8.10 | IC7.11 v25.08,13.65 | v19.69,37.46 IC5.12
AL1  (via drill 0.6)
  Top 0.254: v22.54,13.65 24.13,12.06 24.13,6.03 24.13,5.72 IC8.9 | IC9.9 v73.66,5.72 | v19.37,33.66 19.69,33.34 19.69,27.62 19.69,26.67 18.73,25.72 18.73,24.13 18.73,23.49 18.73,18.73 18.73,17.46 19.05,17.14 IC7.12
  Bottom 0.254: v73.66,5.72 73.34,5.4 45.09,5.4 42.54,7.94 34.29,7.94 33.34,6.98 31.75,6.98 31.12,6.35 29.53,6.35 28.89,5.72 27.31,5.72 26.03,4.44 IC8.9 | v19.37,33.66 23.18,33.66 24.45,34.92 IC5.4 | v22.54,13.65 IC7.12
AL2  (via drill 0.6)
  Top 0.254: v20,13.65 21.59,12.06 21.59,5.72 IC8.8 | IC9.8 v71.12,6.35 | v19.05,41.28 17.46,41.28 16.83,40.64 16.83,25.72 16.83,25.4 16.83,20.95 16.83,20.64 16.83,18.1 17.78,17.14 IC7.13
  Bottom 0.254: IC7.13 v20,13.65 | v71.12,6.35 70.8,6.03 45.4,6.03 42.86,8.57 33.97,8.57 33.02,7.62 31.43,7.62 30.8,6.98 29.21,6.98 28.58,6.35 26.99,6.35 26.35,5.72 24.76,5.72 23.49,4.44 IC8.8 | IC5.7 20.32,42.55 v19.05,41.28
AL3  (via drill 0.6)
  Top 0.254: v17.46,13.65 19.05,12.06 19.05,5.72 IC8.7 | IC9.7 v68.58,6.98 | IC5.9 16.51,43.81 16.51,41.28 16.19,40.96 16.19,18.1 15.24,17.14 IC7.14
  Bottom 0.254: IC7.14 v17.46,13.65 | v68.58,6.98 68.26,6.67 45.72,6.67 43.5,8.89 43.18,9.21 33.65,9.21 32.7,8.26 31.12,8.26 30.48,7.62 28.89,7.62 28.26,6.98 26.67,6.98 26.03,6.35 24.45,6.35 23.81,5.72 22.22,5.72 20.96,4.44 IC8.7
CLR  (via drill 0.6)
  Top 0.254: v30.48,36.83 34.29,33.02 34.29,28.58 IC4.1
  Bottom 0.254: J3.1 30.16,37.15 v30.48,36.83
D0  (via drill 0.6)
  Top 0.254: X1.33 IC10.33 82.87,31.43 v82.87,13.34 | v78.74,13.34 v78.74,5.4 IC9.11
  Bottom 0.254: v82.87,13.34 v78.74,13.34 | IC8.11 31.12,4.44 32.38,5.72 33.97,5.72 34.92,6.67 41.91,6.67 44.45,4.13 77.47,4.13 v78.74,5.4
D1  (via drill 0.6)
  Top 0.254: X1.32 IC10.32 82.23,31.43 82.23,15.24 81.28,14.29 v81.28,5.4 IC9.12
  Bottom 0.254: v81.28,5.4 79.37,3.49 44.13,3.49 41.59,6.03 35.24,6.03 33.65,4.44 IC8.12
D2  (via drill 0.6)
  Top 0.254: X1.31 IC10.31 80.01,31.11 80.01,29.21 79.69,28.89 79.69,20.64 80.01,20.32 v80.01,12.38 | v84.45,12.38 84.45,2.54 IC9.13
  Bottom 0.254: v80.01,12.38 v84.45,12.38 | IC9.13 82.87,2.86 43.81,2.86 41.28,5.4 36.51,5.4 IC8.13
D3  (via drill 0.6)
  Top 0.254: X1.30 IC10.30 77.79,30.8 77.79,16.19 77.47,15.87 v77.47,11.11 | IC8.15 v38.1,13.02
  Bottom 0.254: IC9.15 86.36,12.38 85.09,11.11 v77.47,11.11 63.82,11.11 63.18,10.48 58.74,10.48 58.1,11.11 47.94,11.11 47.63,10.79 40.64,10.79 38.42,13.02 v38.1,13.02
D4  (via drill 0.6)
  Top 0.254: X1.29 IC10.29 74.93,31.11 76.52,31.11 77.15,30.48 77.15,16.51 76.84,16.19 76.84,12.7 v76.52,12.38 | IC8.16 36.19,19.05 v36.19,13.34
  Bottom 0.254: v36.19,13.34 36.83,13.97 38.42,13.97 40.96,11.43 47.31,11.43 47.63,11.75 58.42,11.75 59.06,11.11 62.86,11.11 63.5,11.75 75.88,11.75 v76.52,12.38 76.52,12.7 78.42,14.61 81.28,14.61 IC9.16
D5  (via drill 0.6)
  Top 0.254: X1.28 IC10.28 72.39,31.11 73.98,31.11 74.93,30.16 74.93,28.89 75.25,28.58 75.25,13.97 v75.57,13.65 | IC8.17 34.29,18.42 v34.29,13.65
  Bottom 0.254: v34.29,13.65 35.24,14.61 38.74,14.61 41.28,12.06 46.99,12.06 47.31,12.38 58.74,12.38 59.37,11.75 62.55,11.75 63.18,12.38 74.29,12.38 v75.57,13.65 75.88,13.65 77.79,15.56 79.69,15.56 IC9.17
D6  (via drill 0.6)
  Top 0.254: X1.27 IC10.27 68.58,31.43 69.53,30.48 69.53,24.13 70.17,23.49 70.17,15.56 v72.39,13.34 | IC8.18 31.75,18.42 v31.75,13.97
  Bottom 0.254: v31.75,13.97 33.02,15.24 39.05,15.24 41.59,12.7 46.67,12.7 46.99,13.02 59.06,13.02 59.69,12.38 62.23,12.38 62.86,13.02 72.07,13.02 v72.39,13.34 73.66,14.61 75.57,14.61 78.1,17.14 IC9.18
D7  (via drill 0.6)
  Top 0.254: X1.26 IC10.26 67.31,31.11 67.31,25.4 69.53,23.18 69.53,14.29 v69.85,13.97 | IC8.19 30.16,17.46 v30.16,14.61
  Bottom 0.254: v30.16,14.61 31.43,15.87 39.37,15.87 41.91,13.34 46.35,13.34 46.67,13.65 59.37,13.65 60.01,13.02 61.91,13.02 62.55,13.65 69.53,13.65 v69.85,13.97 71.44,15.56 74.61,15.56 IC9.19
EN-2MHZ  (via drill 0.6)
  Top 0.254: IC3.6 71.12,40.32 69.53,41.91 69.53,46.67 69.85,46.99 v69.85,51.43 | R7.1 R6.2
  Bottom 0.254: IC3.6 72.07,38.42 77.79,38.42 IC2.9 | v69.85,51.43 62.23,51.43 61.91,51.75 52.39,51.75 51.12,50.48 25.08,50.48 23.18,48.58 22.22,48.58 21.59,47.94 21.59,47.63 20,46.04 9.53,46.04 8.57,46.99 R10.2 6.99,46.99 R6.2
EN-A[4..7]->AH  (via drill 0.6)
  Top 0.254: IC7.9 27.94,17.46 26.67,18.73 26.67,20 27.31,20.64 31.43,20.64 39.05,20.64 v40.01,19.69 | IC7.2 v12.7,10.48 | v72.39,25.08 72.39,30.16 71.44,31.11 70.8,31.11 70.17,31.75 70.17,32.07 70.17,35.88 70.49,36.2 71.75,36.2 72.39,36.83 72.39,39.05 73.03,39.69 73.66,40.32 IC3.8
  Bottom 0.254: IC7.9 IC7.10 25.4,14.61 26.03,13.97 26.03,13.34 25.4,12.7 17.14,12.7 14.92,10.48 v12.7,10.48 | IC7.1 IC7.2 | v72.39,25.08 69.85,25.08 69.21,24.45 68.9,24.13 67.95,23.18 59.69,23.18 55.24,23.18 54.61,22.54 54.61,21.27 54.29,20.95 52.39,20.95 52.07,20.64 50.17,18.73 49.21,17.78 42.23,17.78 40.32,19.69 v40.01,19.69
EPROM_A13  (via drill 0.6)
  Top 0.254: JP2.9 42.23,27.31 40.32,25.4 40.32,22.86 40.01,22.54 29.85,22.54 v29.53,22.86
  Bottom 0.254: IC8.26 11.75,21.27 24.13,21.27 26.35,23.49 28.89,23.49 v29.53,22.86
EPROM_A13/A14-EXT  (via drill 0.6)
  Top 0.254: JP2.7 45.72,28.58 48.58,28.58 50.17,26.99 v50.17,22.54
  Bottom 0.254: v50.17,22.54 50.17,23.18 52.07,25.08 61.91,25.08 63.18,26.35 66.04,26.35 67.95,28.26 74.61,28.26 IC1.15
EPROM_A14  (via drill 0.6)
  Top 0.254: v61.6,26.04 61.6,28.26 60.96,28.89 IC1.21
  Bottom 0.254: IC8.27 9.84,21.91 23.81,21.91 25.4,23.49 26.03,24.13 29.53,24.13 31.12,22.54 41.28,22.54 43.5,20.32 47.94,20.32 48.89,21.27 48.89,22.86 51.75,25.72 61.28,25.72 v61.6,26.04
EPROM_A15  (via drill 0.6)
  Top 0.254: v27.94,21.59 42.23,21.59 43.5,20.32 45.09,20.32 JP2.14
  Bottom 0.254: JP5.2 1.59,5.72 2.86,4.44 IC8.1 5.08,12.38 11.43,18.73 11.43,20 12.07,20.64 25.08,20.64 25.72,21.27 27.62,21.27 v27.94,21.59
FETCH_CLOCK_MODE  (via drill 0.6)
  Top 0.254: v23.49,36.2 23.81,35.88 v23.81,28.89
  Bottom 0.254: IC6.12 16.19,35.88 23.18,35.88 v23.49,36.2 | v23.81,28.89 24.13,28.58 26.35,28.58 26.67,28.26 33.97,28.26 34.29,28.58 37.78,28.58 38.42,27.94 40.64,27.94 43.18,25.4 43.18,24.13 43.81,23.49 47.63,23.49 51.12,26.99 60.01,26.99 60.64,27.62 65.41,27.62 67.31,29.53 67.31,30.16 67.95,30.8 76.84,30.8 77.47,30.16 77.47,29.21 78.1,28.58 79.37,28.58 80.01,29.21 80.01,30.48 80.65,31.11 89.54,31.11 90.17,30.48 D1.A D2.A
GND  (via drill 0.6)
  Top 0.61: X1.1 IC10.1
  other vias: 38.1,42.55 21.91,29.53 27.62,13.34 31.75,42.86 40.01,28.89 30.48,27.3 43.18,33.66 88.27,9.21 7.62,17.46 5.4,14.61 12.7,32.38 6.03,33.97 9.84,42.55 12.7,13.65 12.7,37.78 23.18,41.27 23.81,43.5 15.24,13.65 98.74,39.69 84.45,43.18 99.06,42.23 99.06,45.09 91.44,42.86 8.89,13.65 7.62,10.48 1.9,21.27 32.7,46.35 15.56,47.62 1.9,40 6.03,39.05 9.53,45.09 12.7,42.55 88.27,4.76 80.01,7.3 88.27,13.65 82.87,7.3 76.84,7.3 85.09,14.29 80.96,39.69 47.31,47.62 103.19,38.42 91.44,54.61 72.39,51.43 103.19,42.23 58.1,54.61 103.19,45.72 87.63,54.61 40.96,51.75 76.2,37.46 81.28,27.3 76.2,25.72 36.83,24.76 35.24,24.76 12.38,26.99 51.12,1.59 37.46,26.99 17.78,23.81 12.7,17.78 33.02,27.3 94.62,42.55 54.93,54.61 45.09,42.23 37.46,34.92 57.15,18.41 60.01,20 48.89,30.8 44.13,16.83 44.45,9.84 50.48,51.75 72.71,41.91 39.69,3.17 6.03,44.13 20,47.62 45.4,51.75 1.9,44.13 102.87,51.75 48.26,26.04 17.46,49.53 91.76,40.32 1.9,25.4 34.29,3.17 29.21,3.17 24.13,3.17 19.05,3.17 2.86,3.49 1.27,4.76 57.15,0.95 62.23,0.95 67.31,0.95 72.39,0.95 77.47,0.95 82.55,0.95 88.27,0.95 64.77,24.13 12.7,51.75 22.23,51.75 26.99,51.75 17.46,51.75 31.75,51.75 36.51,51.75 8.57,51.75 63.18,52.39 71.12,52.39 67.31,52.39 73.34,26.67 71.12,26.67 67.31,36.51 91.12,46.35 89.22,46.35 3.81,51.75 42.54,23.49
  pour Bottom: 0,52.7 0,2.22 46.67,2.22 48.89,0 89.54,0 89.54,25.4 104.46,25.4 104.46,54.29 93.98,54.29 92.39,55.88 54.61,55.88 53.02,54.29 48.89,54.29 47.31,52.7
  pour Top: 0,52.7 47.31,52.7 48.89,54.29 53.02,54.29 54.61,55.88 92.39,55.88 93.98,54.29 104.46,54.29 104.46,25.4 89.54,25.4 89.54,0 48.89,0 46.67,2.22 0,2.22
  cutout Top: 15.88,2.22 arc90 4.76,0 6.98,2.22
  cutout Bottom: 15.88,2.22 arc90 4.76,0 6.98,2.22
N$1
  Bottom 0.254: R4.2 R3.1
N$2  (via drill 0.6)
  Top 0.254: 90.17,51.43 89.85,51.75 | 89.85,51.75 C2.2 87.63,51.43 | IC2.14 91.44,38.74 90.17,40 90.17,51.43 | 90.17,51.43 89.85,51.75 | IC2.6 85.09,46.35 85.09,51.43 C1.2 87.63,51.43 | 87.63,51.43 87.63,43.81 v86.99,43.18
  Bottom 0.254: J1.1 87.44,42.74 v86.99,43.18
N$3
  Top 0.254: C2.1 92.71,51.43 92.71,41.28 93.98,40 IC2.15
  Bottom 0.254: R4.1 C2.1
N$4
  Top 0.254: IC2.7 82.55,46.35 82.55,51.43 C1.1
  Bottom 0.254: C1.1 R2.1
N$5
  Bottom 0.254: R2.2 R1.1
N$6
  Bottom 0.254: IC2.4 87.31,46.67 66.36,46.67 65.72,46.04 64.45,46.04 IC3.12
N$7
  Top 0.254: R7.2 2.54,45.72 T1.2
N$8  (via drill 0.6)
  Top 0.254: v82.23,43.18 82.23,41.59 84.77,39.05 IC2.12
  Bottom 0.254: IC3.13 61.28,44.77 62.55,43.5 68.26,43.5 68.9,44.13 76.84,44.13 77.15,43.81 77.79,43.18 80.01,43.18 81.92,43.18 v82.23,43.18
N$9
  Bottom 0.254: J2.2 34.29,39.69 35.24,38.74 38.1,38.74 38.74,38.74 39.37,39.37 40.96,39.37 41.59,40 43.5,40 50.17,40 50.48,40 52.07,40 53.34,38.74 55.56,38.74 56.83,38.74 57.15,38.74 58.1,38.74 58.42,38.42 67.63,38.42 IC3.5
N$10
  Top 0.254: T2.2 3.81,42.86 5.08,44.13 R6.1
N$11
  Bottom 0.254: IC3.3 IC3.4
N$12  (via drill 0.6)
  Top 0.254: v39.69,43.5 40.32,42.86 40.32,38.1 v40.01,37.78
  Bottom 0.254: IC4.8 28.89,43.5 29.21,43.81 34.61,43.81 34.92,44.13 39.05,44.13 v39.69,43.5 | IC3.1 57.78,38.1 57.47,38.1 48.58,38.1 47.94,38.74 42.23,38.74 41.28,37.78 v40.01,37.78
N$13
  Bottom 0.254: T2.1 1.27,36.2 1.27,29.21 3.18,27.31 JP4.1
N$14
  Bottom 0.254: R9.2 3.81,31.11 3.81,33.34 5.08,34.61 T2.3
N$21
  Top 0.254: JP4.3 3.49,23.81 3.49,28.58 3.81,28.89 3.81,30.48 5.08,31.75 R8.2
N$22
  Bottom 0.254: R8.1 2.54,35.88 3.81,37.15 3.81,41.28 T1.3
NC0
  Top 0.254: IC10.5 X1.5
NC1
  Top 0.254: X1.35 IC10.35
NC2
  Top 0.254: X1.36 IC10.36
ON-OFF
  Top 0.254: RN1.6 81.28,20.32 80.33,21.27 80.33,28.26 81.28,29.21 IC1.13
  Bottom 0.254: IC1.13 JP1.1
OPT2  (via drill 0.6)
  Top 0.254: RN1.5 IC1.11 v78.74,26.04
  Bottom 0.254: v78.74,26.04 81.6,26.04 82.87,27.31 JP1.3
OPT3
  Top 0.254: IC1.10 RN1.4
  Bottom 0.254: IC1.10 77.47,23.49 78.74,23.49 80.01,24.76 JP1.5
OPT4
  Top 0.254: IC1.9 RN1.3
  Bottom 0.254: IC1.9 73.66,21.91 74.29,21.27 84.14,21.27 JP1.7
OPT5
  Top 0.254: RN1.2 IC1.8
  Bottom 0.254: RN1.2 72.07,20.64 73.34,20.64 84.14,20.64 JP1.9
PHI1  (via drill 0.6)
  Top 0.254: IC10.3 X1.3 | v22.54,47.63 20.32,45.4 v20.32,39.37 20.96,38.74 20.96,28.58 21.59,27.94 21.59,19.05 23.81,16.83 23.81,13.65 25.4,12.06 IC7.7
  Bottom 0.254: v20.32,39.37 20,39.05 16.19,39.05 IC6.14 | X1.3 95.25,48.89 63.18,48.89 62.23,49.85 62.23,50.48 61.6,51.12 52.71,51.12 51.43,49.85 25.4,49.85 23.18,47.63 v22.54,47.63
PHI2
  Top 0.254: IC10.39 X1.39
  Bottom 0.254: IC10.39 98.11,31.43 97.47,31.43 96.52,30.48 96.52,28.26 D2.C
PHI2-IN  (via drill 0.6)
  Bottom 0.254: IC3.11 66.99,46.04 86.99,46.04 87.63,45.4 87.63,44.45 90.81,41.28 v97.79,41.28 100.33,41.28 101.6,40 101.6,37.46 103.19,35.88 103.19,31.75 101.28,29.85 JP3.4
PHI2-IN_OUT
  Top 0.254: IC10.37 95.25,31.11 96.84,31.11 JP3.2
PHI2-INPUT
  Top 0.254: X1.37 92.71,33.66 92.71,28.89 93.34,28.26 97.15,28.26 JP3.1
PHI2-INPUT_OUT  (via drill 0.6)
  Top 0.254: IC2.1 v96.52,39.37 97.47,39.37 98.43,38.42 98.43,37.46 100.33,35.56 100.33,32.07 101.92,30.48 101.92,28.58 JP3.3
  Bottom 0.254: IC2.10 83.18,39.37 v96.52,39.37
PRE  (via drill 0.6)
  Top 0.254: v30.16,42.55 31.75,40.96 31.75,36.83 33.65,34.92 IC4.4
  Bottom 0.254: J3.3 v30.16,42.55
PULLUP
  Top 0.254: R12.1 43.18,26.04 45.72,26.04 JP2.12
Q  (via drill 0.6)
  Top 0.254: v33.34,36.83 34.92,36.83 IC4.5
  Bottom 0.254: J2.1 v33.34,36.83
R/W  (via drill 0.6)
  Top 0.254: X1.34 IC10.34 86.36,29.21 85.73,28.58 v83.82,28.58 | v13.02,22.86 12.07,22.86 11.43,23.49 11.43,25.72 10.48,26.67 10.48,33.66 11.11,34.29 11.11,35.56 10.16,36.51 v10.16,39.69 | v23.18,22.86 25.72,22.86 v26.35,22.22
  Bottom 0.254: v23.18,22.86 22.86,22.54 13.34,22.54 v13.02,22.86 | v26.35,22.22 26.99,22.86 28.26,22.86 29.85,21.27 40.64,21.27 42.86,19.05 48.58,19.05 51.43,21.91 51.43,23.49 52.39,24.45 62.23,24.45 63.5,25.72 66.36,25.72 68.26,27.62 79.69,27.62 80.65,28.58 v83.82,28.58 | v10.16,39.69 12.38,39.69 IC6.15
R/W-RAM  (via drill 0.6)
  Top 0.254: v48.89,39.05 48.58,38.74 48.58,32.7 51.43,29.85 v51.43,17.78 | IC6.13 13.65,39.05 13.65,48.58 R5.1
  Bottom 0.254: IC6.13 16.19,38.42 20.96,38.42 21.27,38.74 23.18,38.74 23.81,38.1 23.81,37.46 24.76,36.51 28.89,36.51 29.53,35.88 31.75,35.88 32.38,35.24 34.29,35.24 34.92,35.88 38.74,35.88 39.05,36.2 39.05,38.1 39.69,38.74 41.28,38.74 41.91,39.37 48.58,39.37 v48.89,39.05 | IC9.27 54.93,18.1 51.75,18.1 v51.43,17.78
RAM-/CS1
  Top 0.254: IC9.20 74.61,18.1 74.61,22.86 74.61,28.26 73.66,29.21 IC1.16
  Bottom 0.254: IC9.22 69.53,18.1 72.71,18.1 IC9.20
RDY
  Top 0.254: IC10.2 X1.2
ROM-/CE  (via drill 0.6)
  Top 0.254: IC1.18 v68.58,26.67
  Bottom 0.254: v68.58,26.67 67.95,26.04 66.99,25.08 63.82,25.08 62.55,23.81 | 62.55,23.81 62.23,23.81 | 62.23,23.81 62.55,23.81 | 62.55,23.81 62.23,23.81 | 62.23,23.81 60.64,23.81 60.01,23.81 52.71,23.81 52.39,23.49 52.07,23.18 52.07,21.59 49.85,19.37 48.89,18.42 42.54,18.42 41.59,19.37 40.32,20.64 32.7,20.64 31.12,20.64 30.8,20.64 30.48,20.64 27.62,20.64 26.35,20.64 IC8.20 24.45,18.73 21.27,18.73 IC8.22
SELECT-A[0..3|4..7]->AL
  Bottom 0.254: IC5.1 26.35,26.35 34.29,26.35 34.92,25.72 39.05,25.72 43.81,20.95 47.63,20.95 48.26,21.59 48.26,23.18 51.43,26.35 60.32,26.35 60.96,26.99 65.72,26.99 67.63,28.89 70.17,28.89 IC1.17
SET-CLOCK-MODE  (via drill 0.6)
  Top 0.254: v30.16,32.7 v31.43,33.97
  Bottom 0.254: IC6.11 16.19,31.43 22.86,31.43 24.76,33.34 29.53,33.34 29.85,33.02 v30.16,32.7 30.48,32.38 34.61,32.38 35.24,32.38 IC4.3 36.19,32.38 37.78,32.38 R11.2 | IC4.11 28.26,34.61 30.8,34.61 v31.43,33.97
SOB
  Top 0.254: X1.38 IC10.38
SYNC
  Top 0.254: X1.7 IC10.7
VCC  (via drill 0.6)
  Top 0.61: X1.8 IC10.8 | IC8.28 5.08,17.14 | 5.08,17.14 6.35,15.87 IC7.16 | 46.99,50.48 23.49,50.48 22.86,49.85 R5.2 20,49.85 IC6.16 | R1.2 73.03,53.34 49.85,53.34 46.99,50.48 | 54.61,15.87 57.15,15.87 IC9.26 | R3.2 100.33,51.43 v100.33,43.5 v100.33,37.46 102.23,37.46 103.19,36.51 C11.1 | IC4.10 29.21,36.2 29.21,28.58 IC4.14 v27.94,25.08 | v11.43,28.58 11.43,33.66 11.75,33.97 11.75,35.88 11.43,36.2 v11.43,41.28 v11.43,45.09 C3.+ 9.53,49.53 R10.1 | C8.1 5.08,17.14 | 46.99,50.48 48.89,48.58 48.89,46.99 C10.1 50.8,37.46 52.07,36.2 52.07,33.66 C7.1 IC1.24 53.34,25.08 54.61,23.81 54.61,20.95 C9.1 IC9.28 54.61,15.87 | v38.42,23.49 38.42,25.08 41.91,28.58 R12.2 | 54.61,15.87 54.61,3.17 IC9.1
  Bottom 0.254: 10.16,28.58 6.35,28.58 R9.1
  Bottom 0.61: R1.2 74.93,51.43 83.82,51.43 | 83.82,51.43 X1.8 | IC2.3 IC2.2 95.57,43.5 v100.33,43.5 | IC2.11 85.09,36.2 95.25,36.2 IC2.16 v100.33,37.46 | 83.82,51.43 100.33,51.43 R3.2 | IC8.28 C6.1 10.16,28.58 v11.43,28.58 16.51,28.58 IC5.16 C5.1 21.91,26.35 23.81,26.35 25.08,25.08 v27.94,25.08 30.16,25.08 C4.1 31.75,23.49 v38.42,23.49 | C10.1 IC3.14 | RN1.1 67.31,18.42 59.69,18.42 IC9.26 | v11.43,45.09 IC6.16 | T1.1 6.35,41.28 v11.43,41.28

### Text on the board
Bottom: Professional Dos V 1.2
tPlace: 1 | 2 | 3 | 4 | 1541 | 1571 | 5 | JP2 | JP3
bPlace: Set according / to ROMset used | Additional / GND | L2 | L1
tNames: Reversed by WoMo / Improved by Tommi_nrw / Layout by shock__ | JP1 options (jumpers set): / 1 ProfDOS enabled / 2 don't replace $0000 RAM / 3 don't replace $C000 ROM / 4 replace $E000 ROM / 5 1571 mode (set JP2/JP3) | Professional DOS 2016 | $0000-$1FFF / Low ROM / $2000-$3FFF / High ROM / $4000-$7FFF / ProfDOS | First GAL-Version by Benutzername / Also thanks to Unseen / & GMP, KiWi, marty, Syken
bNames: No more Schneckenkarussell!